# Altium schematic sheet 28_Pins.SchDoc (part 2 of 4)
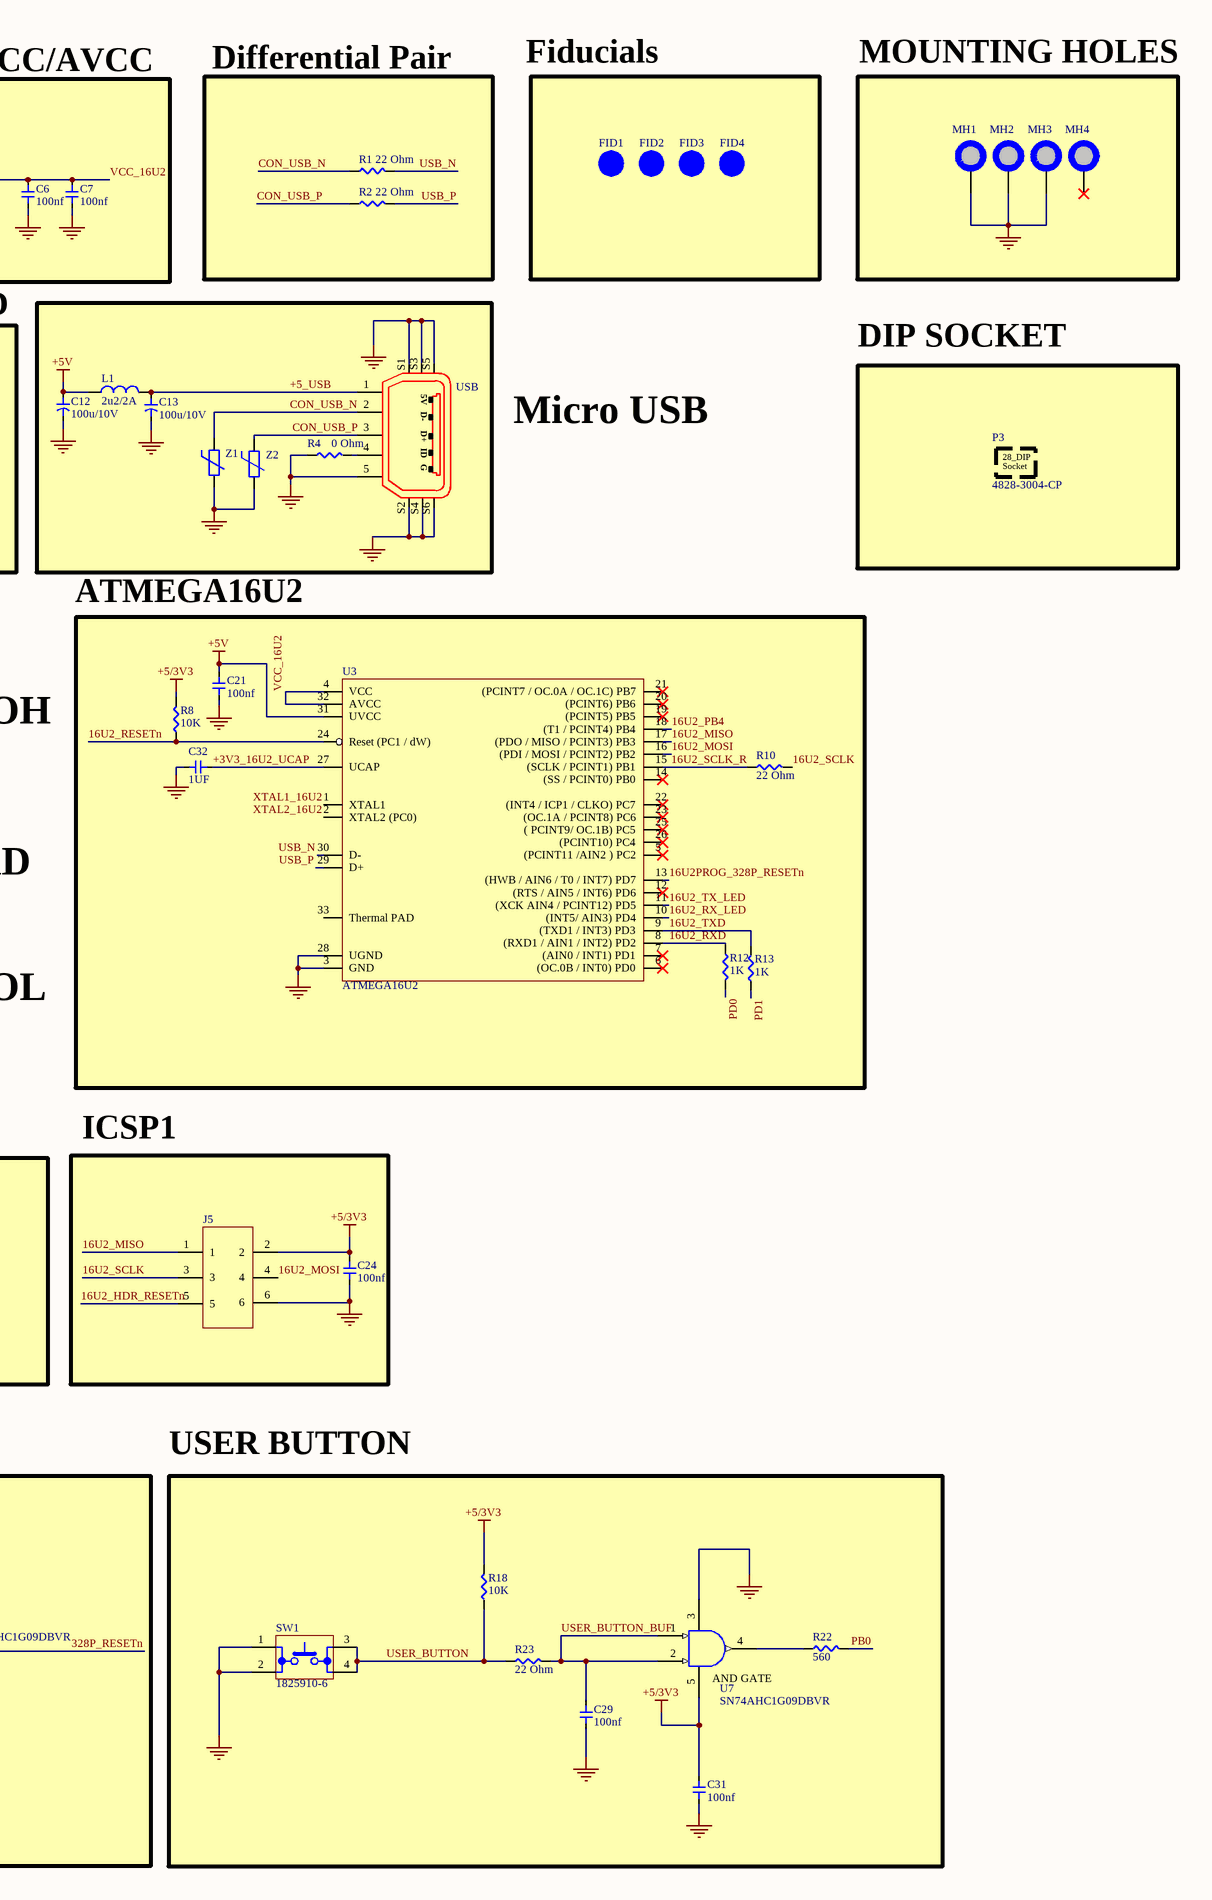
[diagram p2: 28_Pins.SchDoc, right]
## Library data of the parts
C1 C2 C4 C6 C7 C9 C15-C17 C21-C25 C27-C31 C33 C34 = C2012X7R1H104K085AA: C Series 0805 0.1 uF 50 V ±10 % Tolerance X7R SMT Multilayer Ceramic Capacitor; Manufacturer: TDK; Manufacturer Lifecycle Status: PRODUCTION (NOT RECOMMENDED FOR NEW DESIGN); Tolerance: 10%; Voltage: 50V; Supplier 1: Arrow Electronics; Manufacturer Part Number: C2012X7R1H104K085AA; RoHS: Compliant; Category: Ceramic Capacitors; Stock 1: 40; Pricing 1: 1=0.0259 (USD); Capacitance: 100nF; Case/Package: 0805; Case Code (Imperial): 0805; Case Code (Metric): 2012; China RoHS: Compliant; Composition: Ceramic; Depth: 1.25mm; Dielectric: X7R; Dielectric Material: Ceramic; Height: 850µm; Lead Free: Lead Free; Length: 2mm; Lifecycle Status: NRND; Material: Ceramic; Max Length: 2.2mm; Max Operating Temperature: 125°C; Max Width: 1.45mm; Min Length: 1.8mm; Min Operating Temperature: -55°C; Min Width: 1.05mm; Mount: Surface Mount; Number of Pins: 2; Number of Terminals: 2; Radiation Hardening: No; REACH SVHC: Yes; Schedule B: 8532240020, 8532240020|8532240020|8532240020|8532240020|8532240020; Termination: SMD/SMT; Voltage Rating: 50V; Voltage Rating (DC): 50V; Weight: 5.499807mg; Width: 1.25mm; ComponentLink1URL: https://datasheet.octopart.com:443/C2012X7R1H104K085AA-TDK-datasheet-175423548.pdf?src-supplier=IHS; ComponentLink1Description: https://datasheet.octopart.com:443/C2012X7R1H104K085AA-TDK-datasheet-175423548.pdf?src-supplier=IHS; ComponentLink2URL: https://datasheet.octopart.com:443/C2012X7R1H104K085AA-TDK-datasheet-151546523.pdf?src-supplier=ODG+(Origin+Data+Global); ComponentLink2Description: https://datasheet.octopart.com:443/C2012X7R1H104K085AA-TDK-datasheet-151546523.pdf?src-supplier=ODG+(Origin+Data+Global); ComponentLink3URL: https://datasheet.octopart.com:443/C2012X7R1H104K085AA-TDK-datasheet-41194876.pdf?src-supplier=element14+APAC; ComponentLink3Description: https://datasheet.octopart.com:443/C2012X7R1H104K085AA-TDK-datasheet-41194876.pdf?src-supplier=element14+APAC; ComponentLink4URL: https://datasheet.octopart.com:443/C2012X7R1H104K085AA-TDK-datasheet-10978788.pdf?src-supplier=element14+APAC; ComponentLink4Description: https://datasheet.octopart.com:443/C2012X7R1H104K085AA-TDK-datasheet-10978788.pdf?src-supplier=element14+APAC; ComponentLink5URL: https://datasheet.octopart.com:443/C2012X7R1H104K085AA-TDK-datasheet-13376850.pdf?src-supplier=element14+APAC; ComponentLink5Description: https://datasheet.octopart.com:443/C2012X7R1H104K085AA-TDK-datasheet-13376850.pdf?src-supplier=element14+APAC; ComponentLink6URL: https://datasheet.octopart.com:443/C2012X7R1H104K085AA-TDK-datasheet-41169347.pdf?src-supplier=element14+APAC; ComponentLink6Description: https://datasheet.octopart.com:443/C2012X7R1H104K085AA-TDK-datasheet-41169347.pdf?src-supplier=element14+APAC; ComponentLink7URL: https://datasheet.octopart.com:443/C2012X7R1H104K085AA-TDK-datasheet-82475248.pdf?src-supplier=Newark; ComponentLink7Description: https://datasheet.octopart.com:443/C2012X7R1H104K085AA-TDK-datasheet-82475248.pdf?src-supplier=Newark; ComponentLink8URL: https://datasheet.octopart.com:443/C2012X7R1H104K085AA-TDK-datasheet-13444418.pdf?src-supplier=Newark; ComponentLink8Description: https://datasheet.octopart.com:443/C2012X7R1H104K085AA-TDK-datasheet-13444418.pdf?src-supplier=Newark; ComponentLink9URL: https://datasheet.octopart.com:443/C2012X7R1H104K085AA-TDK-datasheet-23766614.pdf?src-supplier=Newark; ComponentLink9Description: https://datasheet.octopart.com:443/C2012X7R1H104K085AA-TDK-datasheet-23766614.pdf?src-supplier=Newark; ComponentLink10URL: https://datasheet.octopart.com:443/C2012X7R1H104K085AA-TDK-datasheet-12509848.pdf?src-supplier=Future+Electronics; ComponentLink10Description: https://datasheet.octopart.com:443/C2012X7R1H104K085AA-TDK-datasheet-12509848.pdf?src-supplier=Future+Electronics; ComponentLink11URL: https://datasheet.octopart.com:443/C2012X7R1H104K085AA-TDK-datasheet-8852320.pdf?src-supplier=Future+Electronics; ComponentLink11Description: https://datasheet.octopart.com:443/C2012X7R1H104K085AA-TDK-datasheet-8852320.pdf?src-supplier=Future+Electronics; ComponentLink12URL: https://datasheet.octopart.com:443/C2012X7R1H104K085AA-TDK-datasheet-8359770.pdf?src-supplier=Future+Electronics; ComponentLink12Description: https://datasheet.octopart.com:443/C2012X7R1H104K085AA-TDK-datasheet-8359770.pdf?src-supplier=Future+Electronics; ComponentLink13URL: https://datasheet.octopart.com:443/C2012X7R1H104K085AA-TDK-datasheet-8324322.pdf?src-supplier=Future+Electronics; ComponentLink13Description: https://datasheet.octopart.com:443/C2012X7R1H104K085AA-TDK-datasheet-8324322.pdf?src-supplier=Future+Electronics; ComponentLink14URL: https://datasheet.octopart.com:443/C2012X7R1H104K085AA-TDK-datasheet-128946.pdf?src-supplier=Future+Electronics; ComponentLink14Description: https://datasheet.octopart.com:443/C2012X7R1H104K085AA-TDK-datasheet-128946.pdf?src-supplier=Future+Electronics; ComponentLink15URL: https://datasheet.octopart.com:443/C2012X7R1H104K085AA-TDK-datasheet-11730548.pdf?src-supplier=Electro+Sonic; ComponentLink15Description: https://datasheet.octopart.com:443/C2012X7R1H104K085AA-TDK-datasheet-11730548.pdf?src-supplier=Electro+Sonic
C3 C5 C8 C14 C20 = C2012X5R1C106M125AC: Ceramic Capacitor, Multilayer, Ceramic, 16V, 20% +Tol, 20% -Tol, X5R, 15% TC, 10uF, Surface Mount, 0805; Manufacturer: TDK; Capacitance: 10µF; Supplier 1: Farnell; Manufacturer Part Number: C2012X5R1C106M125AC; RoHS: Compliant; Category: Ceramic Capacitors; Pricing 1: 2000=0.0662 (GBP); Case Code (Imperial): 0805; Case Code (Metric): 2012; China RoHS: Compliant; Composition: Ceramic; Depth: 1.25mm; Dielectric: X5R; Dielectric Material: Ceramic; Height: 1.25mm; Lead Free: Lead Free; Length: 2mm; Lifecycle Status: Obsolete; Max Operating Temperature: 85°C; Min Operating Temperature: -55°C; Mount: Surface Mount; Number of Pins: 2; Number of Terminals: 2; REACH SVHC: Yes; Termination: SMD/SMT; Tolerance: 20%; Voltage Rating: 16V; Voltage Rating (DC): 16V; Weight: 5.499807mg; Width: 1.25mm; ComponentLink1URL: https://datasheet.octopart.com:443/C2012X5R1C106M125AC-TDK-datasheet-82475248.pdf?src-supplier=Newark; ComponentLink1Description: https://datasheet.octopart.com:443/C2012X5R1C106M125AC-TDK-datasheet-82475248.pdf?src-supplier=Newark; ComponentLink2URL: https://datasheet.octopart.com:443/C2012X5R1C106M125AC-TDK-datasheet-13444418.pdf?src-supplier=Newark; ComponentLink2Description: https://datasheet.octopart.com:443/C2012X5R1C106M125AC-TDK-datasheet-13444418.pdf?src-supplier=Newark; ComponentLink3URL: https://datasheet.octopart.com:443/C2012X5R1C106M125AC-TDK-datasheet-23766614.pdf?src-supplier=Newark; ComponentLink3Description: https://datasheet.octopart.com:443/C2012X5R1C106M125AC-TDK-datasheet-23766614.pdf?src-supplier=Newark; ComponentLink4URL: https://datasheet.octopart.com:443/C2012X5R1C106M125AC-TDK-datasheet-20681607.pdf?src-supplier=Newark; ComponentLink4Description: https://datasheet.octopart.com:443/C2012X5R1C106M125AC-TDK-datasheet-20681607.pdf?src-supplier=Newark; ComponentLink5URL: https://datasheet.octopart.com:443/C2012X5R1C106M125AC-TDK-datasheet-41194876.pdf?src-supplier=element14+APAC; ComponentLink5Description: https://datasheet.octopart.com:443/C2012X5R1C106M125AC-TDK-datasheet-41194876.pdf?src-supplier=element14+APAC; ComponentLink6URL: https://datasheet.octopart.com:443/C2012X5R1C106M125AC-TDK-datasheet-41169347.pdf?src-supplier=element14+APAC; ComponentLink6Description: https://datasheet.octopart.com:443/C2012X5R1C106M125AC-TDK-datasheet-41169347.pdf?src-supplier=element14+APAC
C10 C11 C18 C19 = C0805C180J5GACTU: Ceramic Capacitor 0.079Lx0.049W 2.00mmx1.25mm C0G NP0 ±5% 18pF; Manufacturer: KEMET; Dissipation Factor: 0.1%; Temperature Coefficient: 30ppm/°C; Voltage: 50V; Supplier 1: Arrow Electronics; Manufacturer Part Number: C0805C180J5GACTU; RoHS: Compliant; Category: Ceramic Capacitors; Stock 1: 204000; Pricing 1: 4000=0.0185, 8000=0.017, 12000=0.016, 20000=0.014, 28000=0.014, 40000=0.013, 100000=0.012, 200000=0.011 (USD); Capacitance: 18pF; Case/Package: 0805; Case Code (Imperial): 0805; China RoHS: Compliant; Contact Material: Tin; Depth: 1.25mm; Dielectric: C0G; Dielectric Material: Ceramic; Height: 780µm; Lead Free: Lead Free; Lead Pitch: 750µm; Length: 2mm; Lifecycle Status: Production; Material: Ceramic; Max Operating Temperature: 125°C; Min Operating Temperature: -55°C; Mount: Surface Mount; Number of Pins: 2; Number of Terminals: 2; Packaging: Cut Tape; Radiation Hardening: No; REACH SVHC: Yes; Schedule B: 8532240020, 8532240020|8532240020, 8532240020|8532240020|8532240020, 8532240020|8532240020|8532240020|8532240020; Termination: SMD/SMT; Thickness: 889µm; Tolerance: 5%; Voltage Rating: 50V; Voltage Rating (AC): 50V; Voltage Rating (DC): 50V; Width: 1.25mm; ComponentLink1URL: https://datasheet.octopart.com:443/C0805C180J5GACTU-KEMET-datasheet-178132257.pdf?src-supplier=IHS; ComponentLink1Description: https://datasheet.octopart.com:443/C0805C180J5GACTU-KEMET-datasheet-178132257.pdf?src-supplier=IHS; ComponentLink2URL: https://datasheet.octopart.com:443/C0805C180J5GACTU-KEMET-datasheet-68331921.pdf?src-supplier=element14+APAC; ComponentLink2Description: https://datasheet.octopart.com:443/C0805C180J5GACTU-KEMET-datasheet-68331921.pdf?src-supplier=element14+APAC; ComponentLink3URL: https://datasheet.octopart.com:443/C0805C180J5GACTU-Kemet-datasheet-10282724.pdf?src-supplier=element14+APAC; ComponentLink3Description: https://datasheet.octopart.com:443/C0805C180J5GACTU-Kemet-datasheet-10282724.pdf?src-supplier=element14+APAC; ComponentLink4URL: https://datasheet.octopart.com:443/C0805C180J5GACTU-KEMET-datasheet-176142321.pdf?src-supplier=element14+APAC; ComponentLink4Description: https://datasheet.octopart.com:443/C0805C180J5GACTU-KEMET-datasheet-176142321.pdf?src-supplier=element14+APAC; ComponentLink5URL: https://datasheet.octopart.com:443/C0805C180J5GACTU-KEMET-datasheet-176142314.pdf?src-supplier=element14+APAC; ComponentLink5Description: https://datasheet.octopart.com:443/C0805C180J5GACTU-KEMET-datasheet-176142314.pdf?src-supplier=element14+APAC; ComponentLink6URL: https://datasheet.octopart.com:443/C0805C180J5GACTU-KEMET-datasheet-149524055.pdf?src-supplier=Farnell; ComponentLink6Description: https://datasheet.octopart.com:443/C0805C180J5GACTU-KEMET-datasheet-149524055.pdf?src-supplier=Farnell; ComponentLink7URL: https://datasheet.octopart.com:443/C0805C180J5GACTU-Kemet-datasheet-21202491.pdf?src-supplier=Farnell; ComponentLink7Description: https://datasheet.octopart.com:443/C0805C180J5GACTU-Kemet-datasheet-21202491.pdf?src-supplier=Farnell; ComponentLink8URL: https://datasheet.octopart.com:443/C0805C180J5GACTU-KEMET-datasheet-101576200.pdf?src-supplier=Farnell; ComponentLink8Description: https://datasheet.octopart.com:443/C0805C180J5GACTU-KEMET-datasheet-101576200.pdf?src-supplier=Farnell; ComponentLink9URL: https://datasheet.octopart.com:443/C0805C180J5GACTU-Kemet-datasheet-7833651.pdf?src-supplier=Farnell; ComponentLink9Description: https://datasheet.octopart.com:443/C0805C180J5GACTU-Kemet-datasheet-7833651.pdf?src-supplier=Farnell; ComponentLink10URL: https://datasheet.octopart.com:443/C0805C180J5GACTU-Kemet-datasheet-7601896.pdf?src-supplier=Farnell; ComponentLink10Description: https://datasheet.octopart.com:443/C0805C180J5GACTU-Kemet-datasheet-7601896.pdf?src-supplier=Farnell; ComponentLink11URL: https://datasheet.octopart.com:443/C0805C180J5GACTU-Kemet-datasheet-5316294.pdf?src-supplier=Farnell; ComponentLink11Description: https://datasheet.octopart.com:443/C0805C180J5GACTU-Kemet-datasheet-5316294.pdf?src-supplier=Farnell; ComponentLink12URL: https://datasheet.octopart.com:443/C0805C180J5GACTU-Kemet-datasheet-5314837.pdf?src-supplier=Farnell; ComponentLink12Description: https://datasheet.octopart.com:443/C0805C180J5GACTU-Kemet-datasheet-5314837.pdf?src-supplier=Farnell; ComponentLink13URL: https://datasheet.octopart.com:443/C0805C180J5GACTU-Kemet-datasheet-8092359.pdf?src-supplier=Farnell; ComponentLink13Description: https://datasheet.octopart.com:443/C0805C180J5GACTU-Kemet-datasheet-8092359.pdf?src-supplier=Farnell; ComponentLink14URL: https://datasheet.octopart.com:443/C0805C180J5GACTU-Kemet-datasheet-5313890.pdf?src-supplier=Farnell; ComponentLink14Description: https://datasheet.octopart.com:443/C0805C180J5GACTU-Kemet-datasheet-5313890.pdf?src-supplier=Farnell; ComponentLink15URL: https://datasheet.octopart.com:443/C0805C180J5GACTU-Kemet-datasheet-5390537.pdf?src-supplier=Farnell; ComponentLink15Description: https://datasheet.octopart.com:443/C0805C180J5GACTU-Kemet-datasheet-5390537.pdf?src-supplier=Farnell; ComponentLink16URL: https://datasheet.octopart.com:443/C0805C180J5GACTU-Kemet-datasheet-5314969.pdf?src-supplier=Farnell; ComponentLink16Description: https://datasheet.octopart.com:443/C0805C180J5GACTU-Kemet-datasheet-5314969.pdf?src-supplier=Farnell; ComponentLink17URL: https://datasheet.octopart.com:443/C0805C180J5GACTU-Kemet-datasheet-5314627.pdf?src-supplier=Farnell; ComponentLink17Description: https://datasheet.octopart.com:443/C0805C180J5GACTU-Kemet-datasheet-5314627.pdf?src-supplier=Farnell; ComponentLink18URL: https://datasheet.octopart.com:443/C0805C180J5GACTU-Kemet-datasheet-5389132.pdf?src-supplier=Farnell; ComponentLink18Description: https://datasheet.octopart.com:443/C0805C180J5GACTU-Kemet-datasheet-5389132.pdf?src-supplier=Farnell; ComponentLink19URL: https://datasheet.octopart.com:443/C0805C180J5GACTU-Kemet-datasheet-5313836.pdf?src-supplier=Farnell; ComponentLink19Description: https://datasheet.octopart.com:443/C0805C180J5GACTU-Kemet-datasheet-5313836.pdf?src-supplier=Farnell; ComponentLink20URL: https://datasheet.octopart.com:443/C0805C180J5GACTU-Kemet-datasheet-8111010.pdf?src-supplier=Farnell; ComponentLink20Description: https://datasheet.octopart.com:443/C0805C180J5GACTU-Kemet-datasheet-8111010.pdf?src-supplier=Farnell; ComponentLink21URL: https://datasheet.octopart.com:443/C0805C180J5GACTU-Kemet-datasheet-7541751.pdf?src-supplier=Farnell; ComponentLink21Description: https://datasheet.octopart.com:443/C0805C180J5GACTU-Kemet-datasheet-7541751.pdf?src-supplier=Farnell; ComponentLink22URL: https://datasheet.octopart.com:443/C0805C180J5GACTU-Kemet-datasheet-7627733.pdf?src-supplier=Farnell; ComponentLink22Description: https://datasheet.octopart.com:443/C0805C180J5GACTU-Kemet-datasheet-7627733.pdf?src-supplier=Farnell; ComponentLink23URL: https://datasheet.octopart.com:443/C0805C180J5GACTU-Kemet-datasheet-500041.pdf?src-supplier=Farnell; ComponentLink23Description: https://datasheet.octopart.com:443/C0805C180J5GACTU-Kemet-datasheet-500041.pdf?src-supplier=Farnell; ComponentLink24URL: https://datasheet.octopart.com:443/C0805C180J5GACTU-Kemet-datasheet-5315946.pdf?src-supplier=Farnell; ComponentLink24Description: https://datasheet.octopart.com:443/C0805C180J5GACTU-Kemet-datasheet-5315946.pdf?src-supplier=Farnell; ComponentLink25URL: https://datasheet.octopart.com:443/C0805C180J5GACTU-Kemet-datasheet-5314449.pdf?src-supplier=Newark; ComponentLink25Description: https://datasheet.octopart.com:443/C0805C180J5GACTU-Kemet-datasheet-5314449.pdf?src-supplier=Newark; ComponentLink26URL: https://datasheet.octopart.com:443/C0805C180J5GACTU-KEMET-datasheet-170667456.pdf?src-supplier=Newark; ComponentLink26Description: https://datasheet.octopart.com:443/C0805C180J5GACTU-KEMET-datasheet-170667456.pdf?src-supplier=Newark; ComponentLink27URL: https://datasheet.octopart.com:443/C0805C180J5GACTU-KEMET-datasheet-37178240.pdf?src-supplier=Electro+Sonic; ComponentLink27Description: https://datasheet.octopart.com:443/C0805C180J5GACTU-KEMET-datasheet-37178240.pdf?src-supplier=Electro+Sonic; ComponentLink28URL: https://datasheet.octopart.com:443/C0805C180J5GACTU-Kemet-datasheet-67847120.pdf?src-supplier=TME; ComponentLink28Description: https://datasheet.octopart.com:443/C0805C180J5GACTU-Kemet-datasheet-67847120.pdf?src-supplier=TME; ComponentLink29URL: https://datasheet.octopart.com/C0805C180J5GACTU-KEMET-datasheet-84169754.pdf; ComponentLink29Description: https://datasheet.octopart.com/C0805C180J5GACTU-KEMET-datasheet-84169754.pdf; ComponentLink30URL: https://datasheet.octopart.com:443/C0805C180J5GAC7800-KEMET-datasheet-164857143.pdf?src-supplier=Burklin+Elektronik; ComponentLink30Description: https://datasheet.octopart.com:443/C0805C180J5GAC7800-KEMET-datasheet-164857143.pdf?src-supplier=Burklin+Elektronik; ComponentLink31URL: https://datasheet.octopart.com:443/C0805C180J5GAC-TU-Kemet-datasheet-7585144.pdf?src-supplier=Jameco; ComponentLink31Description: https://datasheet.octopart.com:443/C0805C180J5GAC-TU-Kemet-datasheet-7585144.pdf?src-supplier=Jameco; ComponentLink32URL: https://datasheet.octopart.com:443/C0805C180J5GACTU-Kemet-datasheet-464.pdf?src-supplier=RS+(Formerly+Allied+Electronics); ComponentLink32Description: https://datasheet.octopart.com:443/C0805C180J5GACTU-Kemet-datasheet-464.pdf?src-supplier=RS+(Formerly+Allied+Electronics); Supplier Part Number 1: C0805C180J5GAC7800
C12 C13 = EEE-1AA101WR: Radial Can - SMD ALUMINUM ELECTROLYTIC CAPACITOR S 10V 100muF ±20% 0.197Dia 5.00mm; Manufacturer: Panasonic; Manufacturer Lifecycle Status: NRFND; Capacitance: 100µF; Dissipation Factor: 30%; Leakage Current: 10µA; Life (Hours): 1000hours; Ripple Current: 54mA; Ripple Current (AC): 50mA; Supplier 1: Future Electronics; Manufacturer Part Number: EEE-1AA101WR; RoHS: Compliant; Category: Aluminum Electrolytic Capacitors; Stock 1: 17000; Pricing 1: 1000=0.0627, 3000=0.061, 5000=0.0603, 15000=0.0587, 25000=0.0573 (USD); Case/Package: Radial; Contact Plating: Tin; Diameter: 5mm; Height: 5.4mm; Height - Seated (Max): 5.4102mm; Lead Free: Lead Free; Length: 5.4mm; Lifecycle Status: NRND; Max Operating Temperature: 85°C; Min Operating Temperature: -40°C; Mount: Surface Mount; Number of Terminals: 2; Packaging: Cut Tape; Radiation Hardening: No; REACH SVHC: Yes; Schedule B: 8532220020, 8532220020|8532220020|8532220020|8532220020|8532220020; Part Series: S; Termination: SMD/SMT; Tolerance: 20%; Voltage Rating: 10V; Voltage Rating (DC): 10V; Width: 5.3mm; ComponentLink1URL: https://datasheet.octopart.com:443/EEE-1AA101WR-Panasonic-datasheet-62330071.pdf?src-supplier=Newark; ComponentLink1Description: https://datasheet.octopart.com:443/EEE-1AA101WR-Panasonic-datasheet-62330071.pdf?src-supplier=Newark; ComponentLink2URL: https://datasheet.octopart.com:443/EEE-1AA101WR-Panasonic-datasheet-5314063.pdf?src-supplier=Newark; ComponentLink2Description: https://datasheet.octopart.com:443/EEE-1AA101WR-Panasonic-datasheet-5314063.pdf?src-supplier=Newark; ComponentLink3URL: https://datasheet.octopart.com:443/EEE-1AA101WR-Panasonic-datasheet-41169183.pdf?src-supplier=Newark; ComponentLink3Description: https://datasheet.octopart.com:443/EEE-1AA101WR-Panasonic-datasheet-41169183.pdf?src-supplier=Newark; ComponentLink4URL: https://datasheet.octopart.com:443/EEE-1AA101WR-Panasonic-datasheet-13265900.pdf?src-supplier=RS+(Formerly+Allied+Electronics); ComponentLink4Description: https://datasheet.octopart.com:443/EEE-1AA101WR-Panasonic-datasheet-13265900.pdf?src-supplier=RS+(Formerly+Allied+Electronics); ComponentLink5URL: https://datasheet.octopart.com:443/EEE-1AA101WR-Panasonic-datasheet-34230028.pdf?src-supplier=element14+APAC; ComponentLink5Description: https://datasheet.octopart.com:443/EEE-1AA101WR-Panasonic-datasheet-34230028.pdf?src-supplier=element14+APAC; ComponentLink6URL: https://datasheet.octopart.com:443/EEE-1AA101WR-Panasonic-datasheet-154766114.pdf?src-supplier=Master+Electronics; ComponentLink6Description: https://datasheet.octopart.com:443/EEE-1AA101WR-Panasonic-datasheet-154766114.pdf?src-supplier=Master+Electronics; ComponentLink7URL: https://datasheet.octopart.com:443/EEE-1AA101WR-Panasonic-datasheet-11548988.pdf?src-supplier=Arrow+Electronics; ComponentLink7Description: https://datasheet.octopart.com:443/EEE-1AA101WR-Panasonic-datasheet-11548988.pdf?src-supplier=Arrow+Electronics; ComponentLink8URL: https://datasheet.octopart.com:443/EEE1AA101WR-Panasonic-datasheet-150469818.pdf?src-supplier=TME; ComponentLink8Description: https://datasheet.octopart.com:443/EEE1AA101WR-Panasonic-datasheet-150469818.pdf?src-supplier=TME; ComponentLink9URL: https://sigma.octopart.com:443/150570760/technical_drawing/Panasonic-EEE1AA101WR.pdf?src-supplier=Panasonic+SCT; ComponentLink9Description: https://sigma.octopart.com:443/150570760/technical_drawing/Panasonic-EEE1AA101WR.pdf?src-supplier=Panasonic+SCT; ComponentLink10URL: https://datasheet.octopart.com:443/EEE-1AA101WR-Panasonic-datasheet-6019.pdf?src-supplier=DigiKey; ComponentLink10Description: https://datasheet.octopart.com:443/EEE-1AA101WR-Panasonic-datasheet-6019.pdf?src-supplier=DigiKey; Supplier Part Number 1: 4028584
C32 = C2012X5R1E105K125AA: C Series 0805 1 uF 25 V ±10% Tolerance X5R SMT Multilayer Ceramic Capacitor; Manufacturer: TDK; Manufacturer Lifecycle Status: PRODUCTION; Capacitance: 1µF; Voltage: 25V; Supplier 1: Future Electronics; Manufacturer Part Number: C2012X5R1E105K125AA; RoHS: Compliant; Category: Ceramic Capacitors; Stock 1: 16000; Pricing 1: 2000=0.0296, 6000=0.0289, 10000=0.0285, 30000=0.0278, 50000=0.0272 (USD); Case/Package: 0805; Case Code (Imperial): 0805; Case Code (Metric): 2012; China RoHS: Compliant; Composition: Ceramic; Depth: 1.25mm; Dielectric: X5R; Dielectric Material: Ceramic; Height: 1.25mm; Lead Free: Lead Free; Length: 2mm; Lifecycle Status: Production; Material: Ceramic; Max Length: 2.2mm; Max Operating Temperature: 85°C; Max Width: 1.45mm; Min Length: 1.8mm; Min Operating Temperature: -55°C; Min Width: 1.05mm; Mount: Surface Mount; Number of Pins: 2; Number of Terminals: 2; Radiation Hardening: No; REACH SVHC: Yes; Schedule B: 8532240020, 8532240020|8532240020, 8532240020|8532240020|8532240020, 8532240020|8532240020|8532240020|8532240020; Termination: SMD/SMT; Tolerance: 10%; Voltage Rating: 25V; Voltage Rating (DC): 25V; Weight: 5.499807mg; Width: 1.25mm; ComponentLink1URL: https://datasheet.octopart.com:443/C2012X5R1E105K125AA-TDK-datasheet-175423548.pdf?src-supplier=TME; ComponentLink1Description: https://datasheet.octopart.com:443/C2012X5R1E105K125AA-TDK-datasheet-175423548.pdf?src-supplier=TME; ComponentLink2URL: https://datasheet.octopart.com:443/C2012X5R1E105K125AA-TDK-datasheet-182135025.pdf?src-supplier=TME; ComponentLink2Description: https://datasheet.octopart.com:443/C2012X5R1E105K125AA-TDK-datasheet-182135025.pdf?src-supplier=TME; ComponentLink3URL: https://datasheet.octopart.com:443/C2012X5R1E105K125AA-TDK-datasheet-159617022.pdf?src-supplier=TME; ComponentLink3Description: https://datasheet.octopart.com:443/C2012X5R1E105K125AA-TDK-datasheet-159617022.pdf?src-supplier=TME; ComponentLink4URL: https://datasheet.octopart.com:443/C2012X5R1E105K125AA-TDK-datasheet-151546523.pdf?src-supplier=TDK; ComponentLink4Description: https://datasheet.octopart.com:443/C2012X5R1E105K125AA-TDK-datasheet-151546523.pdf?src-supplier=TDK; ComponentLink5URL: https://datasheet.octopart.com/C2012X5R1E105K125AA-TDK-datasheet-41194876.pdf; ComponentLink5Description: https://datasheet.octopart.com/C2012X5R1E105K125AA-TDK-datasheet-41194876.pdf; ComponentLink6URL: https://datasheet.octopart.com:443/C2012X5R1E105K125AA-TDK-datasheet-20681607.pdf?src-supplier=Newark; ComponentLink6Description: https://datasheet.octopart.com:443/C2012X5R1E105K125AA-TDK-datasheet-20681607.pdf?src-supplier=Newark; ComponentLink7URL: https://datasheet.octopart.com:443/C2012X5R1E105K125AA-TDK-datasheet-82475248.pdf?src-supplier=Newark; ComponentLink7Description: https://datasheet.octopart.com:443/C2012X5R1E105K125AA-TDK-datasheet-82475248.pdf?src-supplier=Newark; ComponentLink8URL: https://datasheet.octopart.com:443/C2012X5R1E105K125AA-TDK-datasheet-8852320.pdf?src-supplier=Newark; ComponentLink8Description: https://datasheet.octopart.com:443/C2012X5R1E105K125AA-TDK-datasheet-8852320.pdf?src-supplier=Newark; ComponentLink9URL: https://datasheet.octopart.com:443/C2012X5R1E105K125AA-TDK-datasheet-13376850.pdf?src-supplier=Newark; ComponentLink9Description: https://datasheet.octopart.com:443/C2012X5R1E105K125AA-TDK-datasheet-13376850.pdf?src-supplier=Newark; ComponentLink10URL: https://datasheet.octopart.com:443/C2012X5R1E105K125AA-TDK-datasheet-10921857.pdf?src-supplier=element14+APAC; ComponentLink10Description: https://datasheet.octopart.com:443/C2012X5R1E105K125AA-TDK-datasheet-10921857.pdf?src-supplier=element14+APAC; ComponentLink11URL: https://datasheet.octopart.com:443/C2012X5R1E105K125AA-TDK-datasheet-12509848.pdf?src-supplier=Future+Electronics; ComponentLink11Description: https://datasheet.octopart.com:443/C2012X5R1E105K125AA-TDK-datasheet-12509848.pdf?src-supplier=Future+Electronics; ComponentLink12URL: https://datasheet.octopart.com:443/C2012X5R1E105K125AA-TDK-datasheet-10978788.pdf?src-supplier=Future+Electronics; ComponentLink12Description: https://datasheet.octopart.com:443/C2012X5R1E105K125AA-TDK-datasheet-10978788.pdf?src-supplier=Future+Electronics; ComponentLink13URL: https://datasheet.octopart.com:443/C2012X5R1E105K125AA-TDK-datasheet-8359770.pdf?src-supplier=Future+Electronics; ComponentLink13Description: https://datasheet.octopart.com:443/C2012X5R1E105K125AA-TDK-datasheet-8359770.pdf?src-supplier=Future+Electronics; ComponentLink14URL: https://datasheet.octopart.com:443/C2012X5R1E105K125AA-TDK-datasheet-8324322.pdf?src-supplier=Future+Electronics; ComponentLink14Description: https://datasheet.octopart.com:443/C2012X5R1E105K125AA-TDK-datasheet-8324322.pdf?src-supplier=Future+Electronics; ComponentLink15URL: https://datasheet.octopart.com:443/C2012X5R1E105K125AA-TDK-datasheet-128946.pdf?src-supplier=Future+Electronics; ComponentLink15Description: https://datasheet.octopart.com:443/C2012X5R1E105K125AA-TDK-datasheet-128946.pdf?src-supplier=Future+Electronics; Supplier Part Number 1: 7969264
D1-D3 = LO L29K-H2K1-24-0-2-R18-Z: LED Uni-Color Orange 610nm Automotive 2-Pin Chip 0603(1608Metric) T/R; Manufacturer: Osram; Supplier 1: DigiKey; Manufacturer Part Number: LO L29K-H2K1-24-0-2-R18-Z; Category: LEDs; Stock 1: 43540; Pricing 1: 1=0.31, 10=0.213, 100=0.1501, 500=0.12158, 1000=0.11215, 2000=0.10413 (USD); Schedule B: 8541402000|8541402000|8541402000|8541402000|8541402000; Supplier Part Number 1: 475-LOL29K-H2K1-24-ZCT-ND
D4 = LG L29K-G2J1-24-0-2-R18-Z: LED Uni-Color Green 572nm 2-Pin Chip 0603(1608Metric) T/R; Manufacturer: Osram; Supplier 1: DigiKey; Manufacturer Part Number: LG L29K-G2J1-24-0-2-R18-Z; Category: LEDs; Stock 1: 280253; Pricing 1: 1=0.32, 10=0.219, 100=0.1543, 500=0.12508, 1000=0.11542, 2000=0.1072 (USD); Supplier Part Number 1: 475-LGL29K-G2J1-24-0-2-R18-ZCT-ND
D5 D6 = BAT54HT1G: Small Signal Schottky Diode, Single, 30 V, 200 Ma, 800 Mv, 600 Ma, 150 C; Manufacturer: onsemi; Manufacturer Lifecycle Status: ACTIVE; Average Rectified Current: 200mA; Breakdown Voltage: 30V; Capacitance: 10pF; Forward Voltage: 240mV; Max Forward Surge Current (Ifsm): 600mA; Max Power Dissipation: 200mW; Max Reverse Leakage Current: 2µA; Number of Elements: 1; Polarity: Standard; Recovery Time: 5ns; Supplier 1: Future Electronics; Manufacturer Part Number: BAT54HT1G; RoHS: Compliant; Category: Schottky Diodes; Stock 1: 24036000; Pricing 1: 3000=0.0857, 6000=0.0842, 9000=0.0833, 12000=0.0827, 15000=0.0808 (USD); China RoHS: Compliant; Contact Plating: Tin; Current Rating: 200mA; Element Configuration: Single; Forward Current: 200mA; Height: 1mm; Lead Free: Lead Free; Length: 1.8mm; Lifecycle Status: Production; Max Operating Temperature: 150°C; Max Output Current: 200mA; Max Repetitive Reverse Voltage (Vrrm): 30V; Max Reverse Voltage (DC): 30V; Max Surge Current: 600mA; Min Operating Temperature: -55°C; Mount: Surface Mount; Number of Pins: 2; Number of Terminals: 2; Output Current: 200mA; Packaging: Tape and Reel; Peak Non-Repetitive Surge Current: 600mA; Peak Reverse Current: 2µA; Power Dissipation: 200mW; Radiation Hardening: No; REACH SVHC: Yes; Reverse Recovery Time: 5ns; Reverse Standoff Voltage: 30V; Reverse Voltage: 30V; Schedule B: 8541100070, 8541100070|8541100070|8541100070|8541100070|8541100070; Voltage Rating (DC): 30V; Width: 1.35mm; ComponentLink1URL: https://datasheet.octopart.com:443/BAT54HT1G-ON-Semiconductor-datasheet-37002776.pdf?src-supplier=Master+Electronics; ComponentLink1Description: https://datasheet.octopart.com:443/BAT54HT1G-ON-Semiconductor-datasheet-37002776.pdf?src-supplier=Master+Electronics; ComponentLink2URL: https://datasheet.octopart.com:443/BAT54HT1G-onsemi-datasheet-189128040.pdf?src-supplier=Master+Electronics; ComponentLink2Description: https://datasheet.octopart.com:443/BAT54HT1G-onsemi-datasheet-189128040.pdf?src-supplier=Master+Electronics; ComponentLink3URL: https://datasheet.octopart.com:443/BAT54HT1G-onsemi-datasheet-180957868.pdf?src-supplier=IHS; ComponentLink3Description: https://datasheet.octopart.com:443/BAT54HT1G-onsemi-datasheet-180957868.pdf?src-supplier=IHS; ComponentLink4URL: https://datasheet.octopart.com:443/BAT54HT1G-Fairchild-Semiconductor-datasheet-21199251.pdf?src-supplier=IHS; ComponentLink4Description: https://datasheet.octopart.com:443/BAT54HT1G-Fairchild-Semiconductor-datasheet-21199251.pdf?src-supplier=IHS; ComponentLink5URL: https://datasheet.octopart.com:443/BAT54HT1G-ON-Semiconductor-datasheet-7594180.pdf?src-supplier=onsemi; ComponentLink5Description: https://datasheet.octopart.com:443/BAT54HT1G-ON-Semiconductor-datasheet-7594180.pdf?src-supplier=onsemi; ComponentLink6URL: https://datasheet.octopart.com:443/BAT54HT1G-onsemi-datasheet-181958672.pdf?src-supplier=Newark; ComponentLink6Description: https://datasheet.octopart.com:443/BAT54HT1G-onsemi-datasheet-181958672.pdf?src-supplier=Newark; ComponentLink7URL: https://datasheet.octopart.com:443/BAT54HT1G-ON-Semiconductor-datasheet-11728044.pdf?src-supplier=Newark; ComponentLink7Description: https://datasheet.octopart.com:443/BAT54HT1G-ON-Semiconductor-datasheet-11728044.pdf?src-supplier=Newark; ComponentLink8URL: https://datasheet.octopart.com:443/BAT54HT1G-Fairchild-Semiconductor-datasheet-67878757.pdf?src-supplier=Newark; ComponentLink8Description: https://datasheet.octopart.com:443/BAT54HT1G-Fairchild-Semiconductor-datasheet-67878757.pdf?src-supplier=Newark; ComponentLink9URL: https://datasheet.octopart.com:443/BAT54HT1G-Fairchild-Semiconductor-datasheet-67910283.pdf?src-supplier=Newark; ComponentLink9Description: https://datasheet.octopart.com:443/BAT54HT1G-Fairchild-Semiconductor-datasheet-67910283.pdf?src-supplier=Newark; ComponentLink10URL: https://datasheet.octopart.com:443/BAT54HT1G-Fairchild-Semiconductor-datasheet-12526481.pdf?src-supplier=Fairchild+Semiconductor; ComponentLink10Description: https://datasheet.octopart.com:443/BAT54HT1G-Fairchild-Semiconductor-datasheet-12526481.pdf?src-supplier=Fairchild+Semiconductor; ComponentLink11URL: https://sigma.octopart.com:443/17344476/technical_drawing/Fairchild-Semiconductor-BAT54HT1G.pdf?src-supplier=Fairchild+Semiconductor; ComponentLink11Description: https://sigma.octopart.com:443/17344476/technical_drawing/Fairchild-Semiconductor-BAT54HT1G.pdf?src-supplier=Fairchild+Semiconductor; ComponentLink12URL: https://datasheet.octopart.com:443/BAT54HT1G-ON-Semiconductor-datasheet-78857375.pdf?src-supplier=element14+APAC; ComponentLink12Description: https://datasheet.octopart.com:443/BAT54HT1G-ON-Semiconductor-datasheet-78857375.pdf?src-supplier=element14+APAC; ComponentLink13URL: https://datasheet.octopart.com:443/BAT54HT1G-Fairchild-Semiconductor-datasheet-14041551.pdf?src-supplier=iiiC; ComponentLink13Description: https://datasheet.octopart.com:443/BAT54HT1G-Fairchild-Semiconductor-datasheet-14041551.pdf?src-supplier=iiiC; ComponentLink14URL: https://datasheet.octopart.com:443/BAT54HT1G-ON-Semiconductor-datasheet-9904951.pdf?src-supplier=RS+(Formerly+Allied+Electronics); ComponentLink14Description: https://datasheet.octopart.com:443/BAT54HT1G-ON-Semiconductor-datasheet-9904951.pdf?src-supplier=RS+(Formerly+Allied+Electronics); ComponentLink15URL: https://datasheet.octopart.com:443/BAT54HT1G-ON-Semiconductor-datasheet-8442547.pdf?src-supplier=Jameco; ComponentLink15Description: https://datasheet.octopart.com:443/BAT54HT1G-ON-Semiconductor-datasheet-8442547.pdf?src-supplier=Jameco; ComponentLink16URL: https://datasheet.octopart.com:443/BAT54HT1G-Fairchild-datasheet-1483.pdf?src-supplier=DigiKey; ComponentLink16Description: https://datasheet.octopart.com:443/BAT54HT1G-Fairchild-datasheet-1483.pdf?src-supplier=DigiKey; ComponentLink17URL: https://datasheet.octopart.com:443/BAT54HT1G-Fairchild-Semiconductor-datasheet-68652800.pdf?src-supplier=Farnell; ComponentLink17Description: https://datasheet.octopart.com:443/BAT54HT1G-Fairchild-Semiconductor-datasheet-68652800.pdf?src-supplier=Farnell; ComponentLink18URL: http://sigma.octopart.com:80/15540786/rohs_certificate/ON-Semiconductor-BAT54HT1G.pdf?src-supplier=Compliance+Statements; ComponentLink18Description: http://sigma.octopart.com:80/15540786/rohs_certificate/ON-Semiconductor-BAT54HT1G.pdf?src-supplier=Compliance+Statements; ComponentLink19URL: http://sigma.octopart.com:80/15674218/materials_sheet/ON-Semiconductor-BAT54HT1G.csv?src-supplier=Compliance+Statements; ComponentLink19Description: http://sigma.octopart.com:80/15674218/materials_sheet/ON-Semiconductor-BAT54HT1G.csv?src-supplier=Compliance+Statements; ComponentLink20URL: http://sigma.octopart.com:80/150604023/rohs_statement/ON-Semiconductor-BAT54HT1G.pdf?src-supplier=Compliance+Statements; ComponentLink20Description: http://sigma.octopart.com:80/150604023/rohs_statement/ON-Semiconductor-BAT54HT1G.pdf?src-supplier=Compliance+Statements; ComponentLink21URL: http://sigma.octopart.com:80/17344520/reach_statement/Fairchild-Semiconductor-BAT54HT1G.pdf?src-supplier=Compliance+Statements; ComponentLink21Description: http://sigma.octopart.com:80/17344520/reach_statement/Fairchild-Semiconductor-BAT54HT1G.pdf?src-supplier=Compliance+Statements; ComponentLink22URL: http://sigma.octopart.com:80/17344521/materials_sheet/Fairchild-Semiconductor-BAT54HT1G.pdf?src-supplier=Compliance+Statements; ComponentLink22Description: http://sigma.octopart.com:80/17344521/materials_sheet/Fairchild-Semiconductor-BAT54HT1G.pdf?src-supplier=Compliance+Statements; ComponentLink23URL: http://sigma.octopart.com:80/33050028/reach_statement/Fairchild-Semiconductor-BAT54HT1G.pdf?src-supplier=Compliance+Statements; ComponentLink23Description: http://sigma.octopart.com:80/33050028/reach_statement/Fairchild-Semiconductor-BAT54HT1G.pdf?src-supplier=Compliance+Statements; ComponentLink24URL: http://sigma.octopart.com:80/33050038/materials_sheet/Fairchild-Semiconductor-BAT54HT1G.pdf?src-supplier=Compliance+Statements; ComponentLink24Description: http://sigma.octopart.com:80/33050038/materials_sheet/Fairchild-Semiconductor-BAT54HT1G.pdf?src-supplier=Compliance+Statements; ComponentLink25URL: http://sigma.octopart.com:80/reach_statement/ON-Semiconductor-company-79.pdf?src-supplier=Compliance+Statements; ComponentLink25Description: http://sigma.octopart.com:80/reach_statement/ON-Semiconductor-company-79.pdf?src-supplier=Compliance+Statements; ComponentLink26URL: http://sigma.octopart.com:80/reach_statement/Fairchild-Semiconductor-company-9.pdf?src-supplier=Compliance+Statements; ComponentLink26Description: http://sigma.octopart.com:80/reach_statement/Fairchild-Semiconductor-company-9.pdf?src-supplier=Compliance+Statements; ComponentLink27URL: http://sigma.octopart.com:80/rohs_statement/Fairchild-Semiconductor-company-10.pdf?src-supplier=Compliance+Statements; ComponentLink27Description: http://sigma.octopart.com:80/rohs_statement/Fairchild-Semiconductor-company-10.pdf?src-supplier=Compliance+Statements; ComponentLink28URL: http://sigma.octopart.com:80/rohs_statement/Fairchild-Semiconductor-company-11.pdf?src-supplier=Compliance+Statements; ComponentLink28Description: http://sigma.octopart.com:80/rohs_statement/Fairchild-Semiconductor-company-11.pdf?src-supplier=Compliance+Statements; ComponentLink29URL: https://octopart.com:443/opatz8j6/c1?t=ulDlWZXKgwukXqlsC5XWoJ50KRmyC63iWa2hZ65r20FE7iGWqsnhcCNjfRAvNj-6Bkxwn5Z5Ql76BsTcOoaN5xruV4BPcEE3r4irONXIDiQ5BrrmAGpxPpBfuiDVABqjx6pCFynqQkva_OXRT4hcKVNvR-BTlBbXPt83sXrEIZVOcryznF4v418TIfC_ZqBY8YokEZ7WD9GBZmf-BUSOYqqi_Tg0IeWscYKpWNwrzp7saJobN2nAb8KKDpycYiZDJSry2v8Duv_EMOZn6YZIo14A7EPcr2RPOz3NewScuGHTscJB8kMsoJpZsmjjtVmO-o-s1ppfnO08cZ4dqrIBEkgXU7lDq1cZ&src-supplier=Compliance+Statements; ComponentLink29Description: https://octopart.com:443/opatz8j6/c1?t=ulDlWZXKgwukXqlsC5XWoJ50KRmyC63iWa2hZ65r20FE7iGWqsnhcCNjfRAvNj-6Bkxwn5Z5Ql76BsTcOoaN5xruV4BPcEE3r4irONXIDiQ5BrrmAGpxPpBfuiDVABqjx6pCFynqQkva_OXRT4hcKVNvR-BTlBbXPt83sXrEIZVOcryznF4v418TIfC_ZqBY8YokEZ7WD9GBZmf-BUSOYqqi_Tg0IeWscYKpWNwrzp7saJobN2nAb8KKDpycYiZDJSry2v8Duv_EMOZn6YZIo14A7EPcr2RPOz3NewScuGHTscJB8kMsoJpZsmjjtVmO-o-s1ppfnO08cZ4dqrIBEkgXU7lDq1cZ&src-supplier=Compliance+Statements; ComponentLink30URL: https://octopart.com:443/opatz8j6/c1?t=TyeLaaiSXL167CMJnJQ6gYy8CR8gktj4xSxZ0soYumI831ejcL9vlZmbzu8vrDwcPVNtWnfmsxXxuBmBl0txqShBQziRiZ4eFW3LswAyMfAeucPc4oTqEz3wuZ_b-4THQYBHhkiHTTsepWaFvzdkkCPQG3qlcpKKHu4A6-ZUzNDwEYar2JJ0cNrViVmnflHA5_iFMik0MeIm8xA1r4TSxt2r2r0Ws6Jj2GDc4DZz7s1xcxo9HmkUIOtF9nzsycwOkEBZOvCcE1HgsrzL_JLQnCBTzE9CUSBfY1htE3Wxk-QldkdxwUrkUvlf927gVZopz1-BuNTAe3mAmMLJO67avi-78arnhAeCzg&src-supplier=Compliance+Statements; ComponentLink30Description: https://octopart.com:443/opatz8j6/c1?t=TyeLaaiSXL167CMJnJQ6gYy8CR8gktj4xSxZ0soYumI831ejcL9vlZmbzu8vrDwcPVNtWnfmsxXxuBmBl0txqShBQziRiZ4eFW3LswAyMfAeucPc4oTqEz3wuZ_b-4THQYBHhkiHTTsepWaFvzdkkCPQG3qlcpKKHu4A6-ZUzNDwEYar2JJ0cNrViVmnflHA5_iFMik0MeIm8xA1r4TSxt2r2r0Ws6Jj2GDc4DZz7s1xcxo9HmkUIOtF9nzsycwOkEBZOvCcE1HgsrzL_JLQnCBTzE9CUSBfY1htE3Wxk-QldkdxwUrkUvlf927gVZopz1-BuNTAe3mAmMLJO67avi-78arnhAeCzg&src-supplier=Compliance+Statements; Supplier Part Number 1: 8184713
FB1-FB3 = MPZ2012S601AT000: Ferrite Beads Multi-Layer Power 600Ohm 25% 100MHz 2A 100mOhm DCR 0805 T/R; Manufacturer: TDK; Manufacturer Lifecycle Status: PRODUCTION; DC Resistance (DCR): 100mΩ; Impedance: 600Ω; Number of Circuits: 1; Supplier 1: Future Electronics; Manufacturer Part Number: MPZ2012S601AT000; RoHS: Compliant; Category: Ferrite Beads and Chips; Stock 1: 56000; Pricing 1: 4000=0.0268, 12000=0.0261, 16000=0.0259, 40000=0.0254, 60000=0.0249 (USD); Case/Package: 0805; Case Code (Imperial): 0805; Case Code (Metric): 2012; China RoHS: Compliant; Core Material: Ferrite; Current Rating: 2A; Height: 850µm; Lead Free: Lead Free; Length: 2mm; Lifecycle Status: Production; Max DC Current: 2A; Max Frequency: 100MHz; Max Length: 2.2mm; Max Operating Temperature: 125°C; Max Width: 1.45mm; Min Length: 1.8mm; Min Operating Temperature: -55°C; Min Width: 1.05mm; Mount: Surface Mount; Packaging: Tape and Reel; REACH SVHC: Yes; Resistance: 100mΩ; RMS Current (Irms): 2A; Schedule B: 8504500000, 8504500000|8504500000|8504500000|8504500000|8504500000; Series Resistance: 100mΩ; Test Frequency: 100MHz; Tolerance: 25%; Width: 1.25mm; ComponentLink1URL: https://datasheet.octopart.com:443/MPZ2012S601AT000-TDK-datasheet-155380320.pdf?src-supplier=ODG+(Origin+Data+Global); ComponentLink1Description: https://datasheet.octopart.com:443/MPZ2012S601AT000-TDK-datasheet-155380320.pdf?src-supplier=ODG+(Origin+Data+Global); ComponentLink2URL: https://datasheet.octopart.com:443/MPZ2012S601AT000-TDK-datasheet-166558464.pdf?src-supplier=Farnell; ComponentLink2Description: https://datasheet.octopart.com:443/MPZ2012S601AT000-TDK-datasheet-166558464.pdf?src-supplier=Farnell; ComponentLink3URL: https://datasheet.octopart.com:443/MPZ2012S601AT000-TDK-datasheet-12512619.pdf?src-supplier=Farnell; ComponentLink3Description: https://datasheet.octopart.com:443/MPZ2012S601AT000-TDK-datasheet-12512619.pdf?src-supplier=Farnell; ComponentLink4URL: https://datasheet.octopart.com:443/MPZ2012S601AT000-TDK-datasheet-8365394.pdf?src-supplier=Farnell; ComponentLink4Description: https://datasheet.octopart.com:443/MPZ2012S601AT000-TDK-datasheet-8365394.pdf?src-supplier=Farnell; ComponentLink5URL: https://datasheet.octopart.com:443/MPZ2012S601AT000-TDK-datasheet-7554990.pdf?src-supplier=Farnell; ComponentLink5Description: https://datasheet.octopart.com:443/MPZ2012S601AT000-TDK-datasheet-7554990.pdf?src-supplier=Farnell; ComponentLink6URL: https://datasheet.octopart.com:443/MPZ2012S601AT000-TDK-datasheet-39118740.pdf?src-supplier=Upverter; ComponentLink6Description: https://datasheet.octopart.com:443/MPZ2012S601AT000-TDK-datasheet-39118740.pdf?src-supplier=Upverter; ComponentLink7URL: https://datasheet.octopart.com:443/MPZ2012S601AT000-TDK-datasheet-82475261.pdf?src-supplier=Newark; ComponentLink7Description: https://datasheet.octopart.com:443/MPZ2012S601AT000-TDK-datasheet-82475261.pdf?src-supplier=Newark; ComponentLink8URL: https://datasheet.octopart.com:443/MPZ2012S601AT000-TDK-datasheet-41739209.pdf?src-supplier=Newark; ComponentLink8Description: https://datasheet.octopart.com:443/MPZ2012S601AT000-TDK-datasheet-41739209.pdf?src-supplier=Newark; ComponentLink9URL: https://datasheet.octopart.com:443/MPZ2012S601AT000-TDK-datasheet-21218011.pdf?src-supplier=Newark; ComponentLink9Description: https://datasheet.octopart.com:443/MPZ2012S601AT000-TDK-datasheet-21218011.pdf?src-supplier=Newark; ComponentLink10URL: https://datasheet.octopart.com:443/MPZ2012S601AT000-TDK-datasheet-21631858.pdf?src-supplier=Future+Electronics; ComponentLink10Description: https://datasheet.octopart.com:443/MPZ2012S601AT000-TDK-datasheet-21631858.pdf?src-supplier=Future+Electronics; ComponentLink11URL: https://datasheet.octopart.com:443/MPZ2012S601AT000-TDK-datasheet-62109747.pdf?src-supplier=Electro+Sonic; ComponentLink11Description: https://datasheet.octopart.com:443/MPZ2012S601AT000-TDK-datasheet-62109747.pdf?src-supplier=Electro+Sonic; ComponentLink12URL: https://datasheet.octopart.com:443/MPZ2012S601AT000-TDK-datasheet-155118627.pdf?src-supplier=Master+Electronics; ComponentLink12Description: https://datasheet.octopart.com:443/MPZ2012S601AT000-TDK-datasheet-155118627.pdf?src-supplier=Master+Electronics
FID1-FID4 = Fid_1MMC: 1.2mil
J1 J4 = M20-7820842: 8 contacts,2.54mm (0.1) Pitch SIL Vertical PC Tail Socket Assembly, selective gold + tin,; Manufacturer: Harwin; Connector Type: Receptacle, Socket; Contact Resistance: 20mΩ; Current Rating: 3A; Dielectric Material: Polyamide; Gender: Female; Insulation Resistance: 1GΩ; Number of Contacts: 8; Supplier 1: DigiKey; Manufacturer Part Number: M20-7820842; RoHS: Compliant; Category: Card Edge Connectors; Stock 1: 595; Pricing 1: 1=1.27, 27=1.0063, 108=0.91231, 513=0.81725, 1026=0.77824, 5022=0.69577, 10017=0.66272 (USD); Case/Package: SIL; Color: Black; Contact Gender: Female; Contact Material: Bronze; Contact Plating: Gold, Tin; Depth: 2.5mm; Housing Color: Black; Housing Material: Polyamide; Length: 20.72mm; Lifecycle Status: Production; Max Current Rating: 3A; Max Operating Temperature: 105°C; Min Operating Temperature: -40°C; Mount: Through Hole; Number of Pins: 8; Number of Positions: 8; Number of Rows: 1; Orientation: Straight; Pitch: 2.54mm; Radiation Hardening: No; REACH SVHC: Yes; Terminal Pitch: 2.54mm; Termination: Solder; Weight: 719.992839mg; ComponentLink1URL: https://datasheet.octopart.com:443/M20-7820842-Harwin-datasheet-176383844.pdf?src-supplier=Newark; ComponentLink1Description: https://datasheet.octopart.com:443/M20-7820842-Harwin-datasheet-176383844.pdf?src-supplier=Newark; ComponentLink2URL: https://datasheet.octopart.com:443/M20-7820842-Harwin-datasheet-99119574.pdf?src-supplier=Electro+Sonic; ComponentLink2Description: https://datasheet.octopart.com:443/M20-7820842-Harwin-datasheet-99119574.pdf?src-supplier=Electro+Sonic; ComponentLink3URL: http://sigma.octopart.com:80/15888290/rohs_statement/Harwin-M20-7820842.pdf?src-supplier=Compliance+Statements; ComponentLink3Description: http://sigma.octopart.com:80/15888290/rohs_statement/Harwin-M20-7820842.pdf?src-supplier=Compliance+Statements
J2 = M20-7821046: Conn Socket Strip Receptacle 10 Position 2.54mm Solder Straight Through Hole Tube; Manufacturer: Harwin; Connector Type: Receptacle, Socket; Contact Resistance: 20mΩ; Current Rating: 3A; Dielectric Material: Polyamide; Gender: Female; Hole Diameter: 800µm; Insulation Resistance: 1GΩ; Number of Contacts: 10; Operating Force: 4.8928N; Supplier 1: DigiKey; Manufacturer Part Number: M20-7821046; RoHS: Compliant; Category: Card Edge Connectors; Stock 1: 1259; Pricing 1: 1=1.37, 22=1.10409, 110=0.98555, 506=0.88482, 1012=0.84258, 5016=0.75263, 10010=0.71686 (USD); Case/Package: SIL; Color: Black; Contact Gender: Female; Contact Material: Bronze; Contact Plating: Tin; Depth: 2.5mm; Housing Color: Black; Housing Material: Polyamide; Lead Pitch: 2.54mm; Length: 25.8mm; Lifecycle Status: Production; Max Current Rating: 3A; Max Operating Temperature: 105°C; Min Operating Temperature: -40°C; Mount: Through Hole; Number of Pins: 10; Number of Positions: 10; Number of Rows: 1; Orientation: Straight; Pitch: 2.54mm; Radiation Hardening: No; REACH SVHC: Yes; Terminal Pitch: 2.54mm; Termination: Solder; ComponentLink1URL: https://datasheet.octopart.com:443/M20-7821046-Harwin-datasheet-176383844.pdf?src-supplier=Electro+Sonic; ComponentLink1Description: https://datasheet.octopart.com:443/M20-7821046-Harwin-datasheet-176383844.pdf?src-supplier=Electro+Sonic; ComponentLink2URL: https://datasheet.octopart.com:443/M20-7821046-Harwin-datasheet-99119574.pdf?src-supplier=Upverter; ComponentLink2Description: https://datasheet.octopart.com:443/M20-7821046-Harwin-datasheet-99119574.pdf?src-supplier=Upverter; ComponentLink3URL: https://datasheet.octopart.com:443/M20-7821046-Harwin-datasheet-526273.pdf?src-supplier=Upverter; ComponentLink3Description: https://datasheet.octopart.com:443/M20-7821046-Harwin-datasheet-526273.pdf?src-supplier=Upverter; ComponentLink4URL: https://datasheet.octopart.com:443/M20-7821046-Harwin-datasheet-96624206.pdf?src-supplier=element14+APAC; ComponentLink4Description: https://datasheet.octopart.com:443/M20-7821046-Harwin-datasheet-96624206.pdf?src-supplier=element14+APAC; ComponentLink5URL: https://datasheet.octopart.com:443/M20-7821046-Harwin-datasheet-6396485.pdf?src-supplier=Newark; ComponentLink5Description: https://datasheet.octopart.com:443/M20-7821046-Harwin-datasheet-6396485.pdf?src-supplier=Newark; ComponentLink6URL: https://datasheet.octopart.com:443/M20-7821046-Harwin-datasheet-32864534.pdf?src-supplier=Newark; ComponentLink6Description: https://datasheet.octopart.com:443/M20-7821046-Harwin-datasheet-32864534.pdf?src-supplier=Newark; ComponentLink7URL: https://datasheet.octopart.com:443/M20-7821046-Harwin-datasheet-15888280.pdf?src-supplier=Newark; ComponentLink7Description: https://datasheet.octopart.com:443/M20-7821046-Harwin-datasheet-15888280.pdf?src-supplier=Newark; ComponentLink8URL: https://datasheet.octopart.com:443/M20-7821046-Harwin-datasheet-188872139.pdf?src-supplier=TME; ComponentLink8Description: https://datasheet.octopart.com:443/M20-7821046-Harwin-datasheet-188872139.pdf?src-supplier=TME; ComponentLink9URL: https://datasheet.octopart.com:443/M20-7821046-Harwin-datasheet-14706651.pdf?src-supplier=Farnell; ComponentLink9Description: https://datasheet.octopart.com:443/M20-7821046-Harwin-datasheet-14706651.pdf?src-supplier=Farnell; ComponentLink10URL: http://sigma.octopart.com:80/15888295/rohs_statement/Harwin-M20-7821046.pdf?src-supplier=Compliance+Statements; ComponentLink10Description: http://sigma.octopart.com:80/15888295/rohs_statement/Harwin-M20-7821046.pdf?src-supplier=Compliance+Statements
J3 = M20-7820646: Conn Socket Strip Receptacle 6 Position 2.54mm Solder Straight Through Hole Tube; Manufacturer: Harwin; Connector Type: Receptacle, Socket; Contact Resistance: 20mΩ; Current Rating: 3A; Dielectric Material: Polyamide; Gender: Female; Insulation Resistance: 1GΩ; Number of Contacts: 6; Supplier 1: DigiKey; Manufacturer Part Number: M20-7820646; RoHS: Compliant; Category: Card Edge Connectors; Stock 1: 415; Pricing 1: 1=1.11, 36=0.86417, 108=0.79954, 504=0.7171, 1008=0.68287, 5004=0.60989, 10008=0.58081 (USD); Case/Package: SIL; Color: Black; Contact Gender: Female; Contact Material: Bronze; Contact Plating: Tin; Depth: 2.5mm; Housing Color: Black; Housing Material: Nylon; Length: 15.64mm; Lifecycle Status: Production; Max Current Rating: 3A; Max Operating Temperature: 105°C; Min Operating Temperature: -40°C; Mount: Through Hole; Number of Pins: 6; Number of Positions: 6; Number of Rows: 1; Orientation: Straight; Pitch: 2.54mm; Radiation Hardening: No; REACH SVHC: Yes; Terminal Pitch: 2.54mm; Termination: Solder; ComponentLink1URL: https://datasheet.octopart.com:443/M20-7820646-Harwin-datasheet-176383844.pdf?src-supplier=Newark; ComponentLink1Description: https://datasheet.octopart.com:443/M20-7820646-Harwin-datasheet-176383844.pdf?src-supplier=Newark; ComponentLink2URL: https://datasheet.octopart.com:443/M20-7820646-Harwin-datasheet-99119574.pdf?src-supplier=Farnell; ComponentLink2Description: https://datasheet.octopart.com:443/M20-7820646-Harwin-datasheet-99119574.pdf?src-supplier=Farnell; ComponentLink3URL: https://datasheet.octopart.com:443/M20-7820646-Harwin-datasheet-188872139.pdf?src-supplier=TME; ComponentLink3Description: https://datasheet.octopart.com:443/M20-7820646-Harwin-datasheet-188872139.pdf?src-supplier=TME; ComponentLink4URL: https://datasheet.octopart.com:443/M20-7820646-Harwin-datasheet-137074310.pdf?src-supplier=X-ON; ComponentLink4Description: https://datasheet.octopart.com:443/M20-7820646-Harwin-datasheet-137074310.pdf?src-supplier=X-ON; ComponentLink5URL: http://sigma.octopart.com:80/15888285/rohs_statement/Harwin-M20-7820646.pdf?src-supplier=Compliance+Statements; ComponentLink5Description: http://sigma.octopart.com:80/15888285/rohs_statement/Harwin-M20-7820646.pdf?src-supplier=Compliance+Statements